# EAGLE design fob-o-matic (EAGLE 7.7.0)
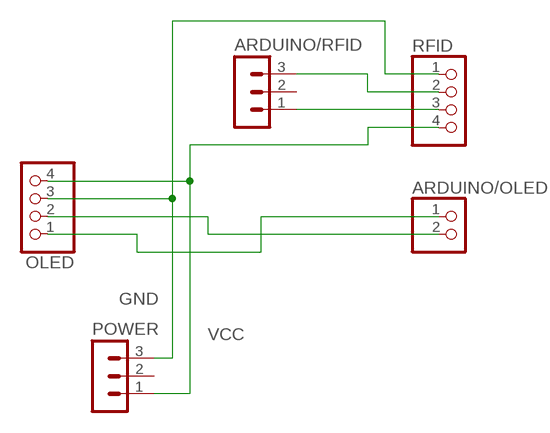
[diagram p0: schematic, sheet 1]

## Parts
ARDUINO/OLED  PINHD-1X2  [1X02]
ARDUINO/RFID  MA03-1  [MA03-1]
OLED  PINHD-1X4/90  [1X04/90]
POWER  MA03-1  [MA03-1]
RFID  PINHD-1X4/90  [1X04/90]

## Nets
/ENABLE: ARDUINO/RFID.1 RFID.3
GND: OLED.3 POWER.3 RFID.1
RX: ARDUINO/RFID.3 RFID.2
SCL: ARDUINO/OLED.2 OLED.2
SDA: ARDUINO/OLED.1 OLED.1
VCC: OLED.4 POWER.1 RFID.4
Unconnected: ARDUINO/RFID.2 POWER.2

## Library data of the parts
ARDUINO/OLED = pinhead:PINHD-1X2: PIN HEADER
ARDUINO/RFID POWER = con-lstb:MA03-1: PIN HEADER; OC_FARNELL: unknown; OC_NEWARK: unknown
OLED RFID = pinhead:PINHD-1X4: PIN HEADER

## Board
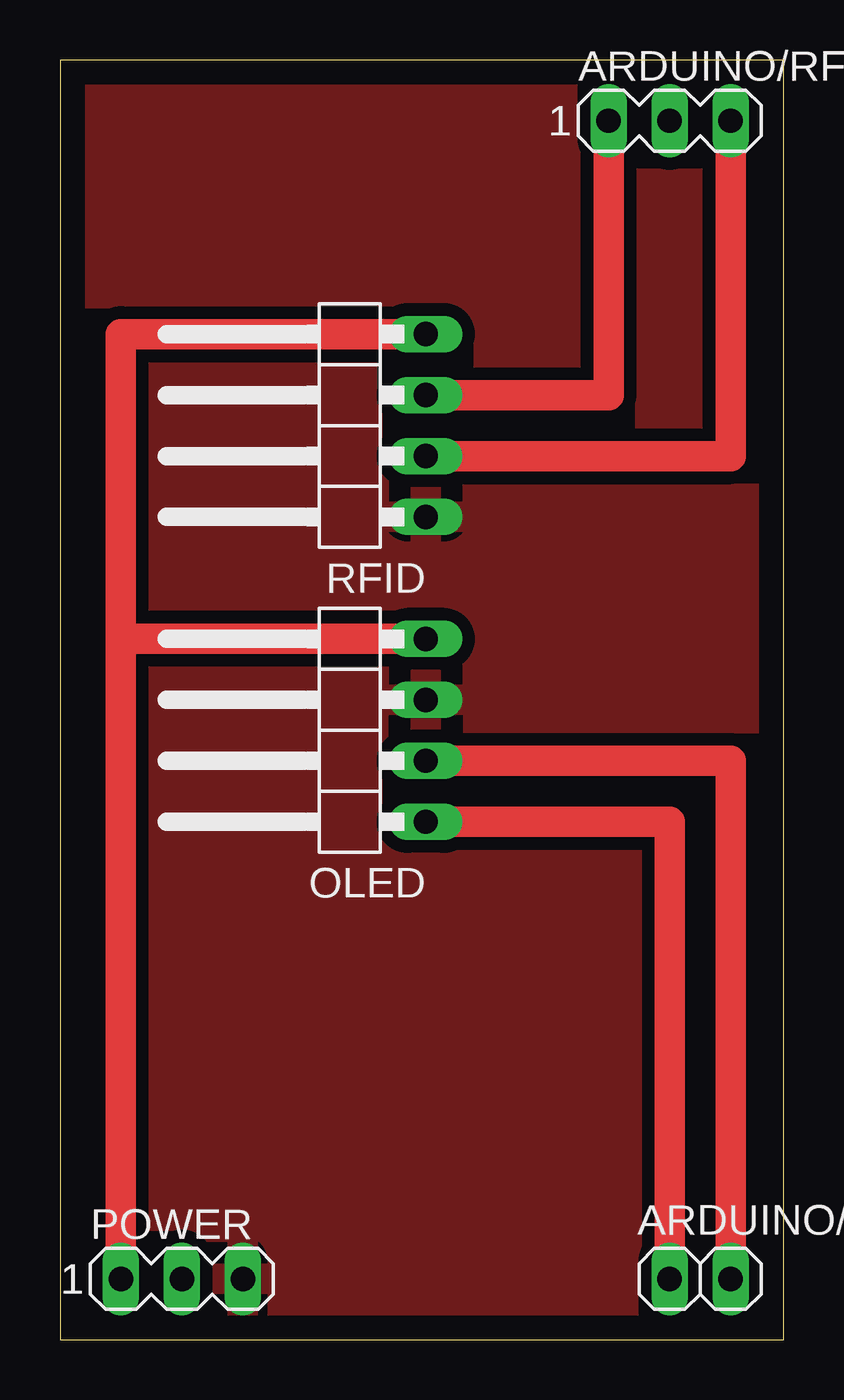
[diagram p1: board, top side]

Size 30.15 x 53.33 mm. Coordinates in mm from the lower left corner, seen from the top.
Outline: 0,0 30.15,0 30.15,53.33 0,53.33 0,0
Copper layers (1*16): Top 0.035mm / dielectric 1.5mm / Bottom 0.035mm
Design rules "default": minimum track width 10mil, minimum drill 24mil, track to track 8mil, track to pad 8mil, pad to pad 8mil, via to via 8mil, smd to smd 8mil, copper to edge 40mil, drill to drill 8mil, minimum pad ring 10mil, minimum via ring 8mil, stop-mask expansion 4mil, vias tented up to drill 0mil, thermal gap 10mil

### Footprints (pad centres in the part's own frame; a part is rotated, then mirrored left to right if it is on the bottom)
1X02 = drill 1.016 long: 1 -1.27,0; 2 1.27,0
MA03-1 = drill 1.016 long: 1 -2.54,0; 2 0,0; 3 2.54,0
1X04/90 = drill 1.016 long: 1 -3.81,-3.81; 2 -1.27,-3.81; 3 1.27,-3.81; 4 3.81,-3.81

### Placement (x,y rotation side)
ARDUINO/OLED  26.67,2.54 0 top
ARDUINO/RFID  25.4,50.8 0 top
OLED  11.43,25.4 90 top
POWER  5.08,2.54 0 top
RFID  11.43,38.1 90 top

### Tracks (layer width: path | path; a pad name or v marks a point on that pad's centre or on a via)
/ENABLE
  Top 1.27: RFID.3 22.86,39.37 ARDUINO/RFID.1
GND
  pour Top (isolate 0.533, rank 6): 1.27,52.07 29.21,52.07 29.21,1.27 1.27,1.27
RX
  Top 1.27: RFID.2 27.94,36.83 ARDUINO/RFID.3
SCL
  Top 1.27: OLED.2 27.94,24.13 ARDUINO/OLED.2
SDA
  Top 1.27: OLED.1 25.4,21.59 ARDUINO/OLED.1
VCC
  Top 1.27: POWER.1 2.54,29.21 | OLED.4 2.54,29.21 | 2.54,29.21 2.54,41.91 RFID.4